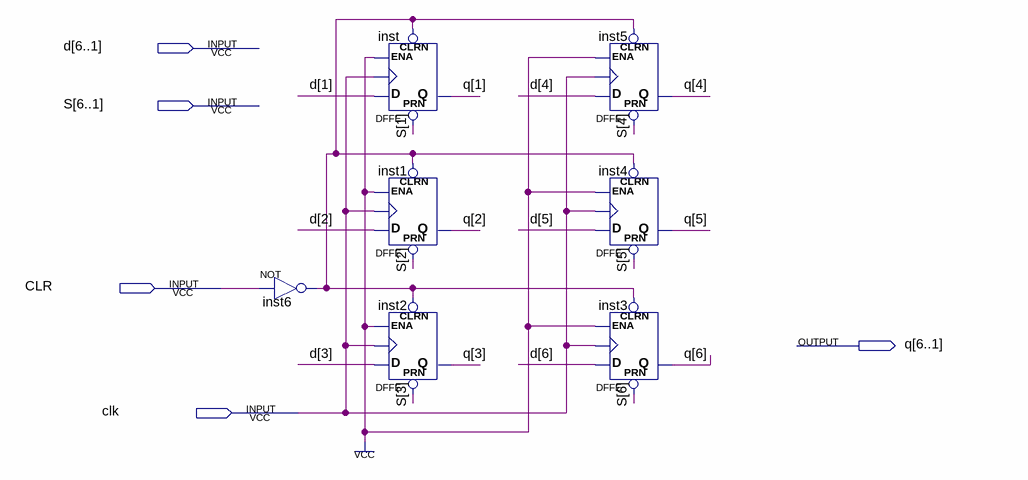
[diagram p0: schematic sheet]
// Quartus schematic uA_reg.bdf as structural Verilog: 7 symbols, 5 pins
module uA_reg (
  input  [6:1] d,
  input  [6:1] S,
  input  CLR,
  input  clk,
  output [6:1] q
);

  wire inst6_out;

  not inst6 (inst6_out, CLR);
  DFFE inst (.PRN(S[1]), .CLRN(inst6_out), .D(d[1]), .CLK(clk), .ENA(1'b1), .Q(q[1]));
  DFFE inst1 (.PRN(S[2]), .CLRN(inst6_out), .D(d[2]), .CLK(clk), .ENA(1'b1), .Q(q[2]));
  DFFE inst2 (.PRN(S[3]), .CLRN(inst6_out), .D(d[3]), .CLK(clk), .ENA(1'b1), .Q(q[3]));
  DFFE inst5 (.PRN(S[4]), .CLRN(inst6_out), .D(d[4]), .CLK(clk), .ENA(1'b1), .Q(q[4]));
  DFFE inst4 (.PRN(S[5]), .CLRN(inst6_out), .D(d[5]), .CLK(clk), .ENA(1'b1), .Q(q[5]));
  DFFE inst3 (.PRN(S[6]), .CLRN(inst6_out), .D(d[6]), .CLK(clk), .ENA(1'b1), .Q(q[6]));
endmodule
